# EAGLE design p1-001 (EAGLE 9.1.0)
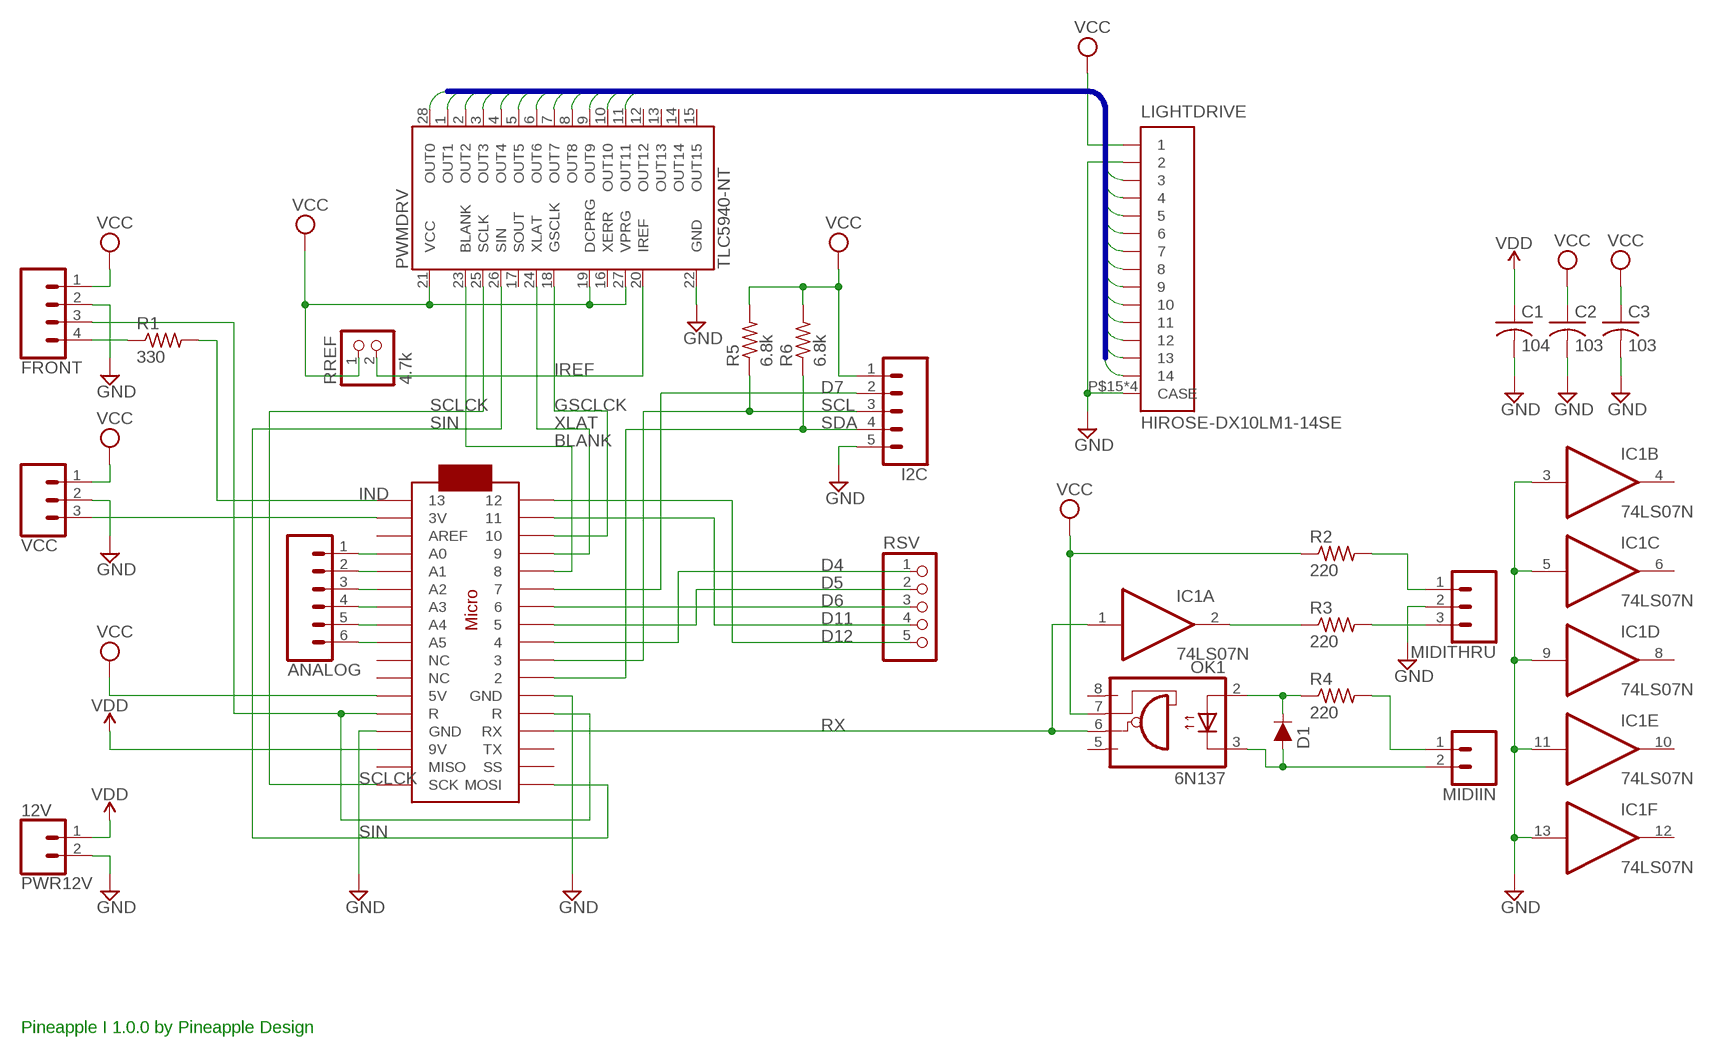
[diagram p0: schematic, sheet 1]

## Parts
ANALOG  CONN_061.27MM  [1X06_1.27MM]
C1  104  C-US025-025X050  [C025-025X050]
C2  103  C-US025-025X050  [C025-025X050]
C3  103  C-US025-025X050  [C025-025X050]
D1  DIODE-1N4148  [DIODE-1N4148]
FRONT  CONN_04JST-PTH  [JST-4-PTH]
I2C  CONN_05SMD2  [1X05_1MM_RA]
IC1  74LS07N  [DIL14]
LIGHTDRIVE  HIROSE-DX10LM1-14SE  [HIROSE-DX10LM1-14SE]
MIDIIN  CONN_02JST-PTH-2  [JST-2-PTH]
MIDITHRU  CONN_03JST-PTH  [JST-3-PTH]
OK1  6N137  [DIL08]
PWMDRV  TLC5940-NT  [DIL28-3]
PWR12V  12V  CONN_02JST-PTH-2  [JST-2-PTH]
R1  330  R-US_0204/5  [0204/5]
R2  220  R-US_0204/5  [0204/5]
R3  220  R-US_0204/5  [0204/5]
R4  220  R-US_0204/5  [0204/5]
R5  6.8k  R-US_0204/5  [0204/5]
R6  6.8k  R-US_0204/5  [0204/5]
RREF  4.7k  PINHD-1X2  [1X02]
RSV  PINHD-1X5  [1X05]
U$1  ARDUINOMICRO  [ARDUINOMICRO]
VCC  CONN_03JST-PTH  [JST-3-PTH]

## Nets
BLANK: PWMDRV.23(BLANK) U$1.P$5
D4: RSV.1 U$1.P$9
D5: RSV.2 U$1.P$8
D6: RSV.3 U$1.P$7
D7: I2C.2 U$1.P$6
D11: RSV.4 U$1.P$2
D12: RSV.5 U$1.P$1
GND: C1.2 C2.2 C3.2 FRONT.2 I2C.5 IC1.3(B:I) IC1.5(C:I) IC1.9(D:I) IC1.11(E:I) IC1.13(F:I) LIGHTDRIVE.P$2 LIGHTDRIVE.P$15(CASE) LIGHTDRIVE.P$16(CASE) LIGHTDRIVE.P$17(CASE) LIGHTDRIVE.P$18(CASE) MIDITHRU.2 PWMDRV.22(GND) PWR12V.2 U$1.P$12(GND) U$1.P$21(GND) VCC.2
GSCLCK: PWMDRV.18(GSCLK) U$1.P$3
IND: R1.2 U$1.P$34
IREF: PWMDRV.20(IREF) RREF.2
LD1: LIGHTDRIVE.P$3 PWMDRV.28(OUT0)
LD2: LIGHTDRIVE.P$4 PWMDRV.1(OUT1)
LD3: LIGHTDRIVE.P$5 PWMDRV.2(OUT2)
LD4: LIGHTDRIVE.P$6 PWMDRV.3(OUT3)
LD5: LIGHTDRIVE.P$7 PWMDRV.4(OUT4)
LD6: LIGHTDRIVE.P$8 PWMDRV.5(OUT5)
LD7: LIGHTDRIVE.P$9 PWMDRV.6(OUT6)
LD8: LIGHTDRIVE.P$10 PWMDRV.7(OUT7)
LD9: LIGHTDRIVE.P$11 PWMDRV.8(OUT8)
LD10: LIGHTDRIVE.P$12 PWMDRV.9(OUT9)
LD11: LIGHTDRIVE.P$13 PWMDRV.10(OUT10)
LD12: LIGHTDRIVE.P$14 PWMDRV.11(OUT11)
MIDIIN+: MIDIIN.1 R4.2
MIDIIN-: D1.A MIDIIN.2 OK1.3(C)
MIDITHRU+: MIDITHRU.1 R2.2
MIDITHRU-: MIDITHRU.3 R3.2
N$2: IC1.2(A:O) R3.1
N$3: FRONT.4 R1.1
N$5: D1.C OK1.2(A) R4.1
N$9: ANALOG.1 U$1.P$31(A0)
N$10: ANALOG.2 U$1.P$30(A1)
N$11: ANALOG.3 U$1.P$29(A2)
N$12: ANALOG.4 U$1.P$28(A3)
N$13: ANALOG.5 U$1.P$27(A4)
N$14: ANALOG.6 U$1.P$26(A5)
RST: FRONT.3 U$1.P$13(R) U$1.P$22(R)
RX: IC1.1(A:I) OK1.6(VO) U$1.P$14(RX)
SCL: I2C.3 R5.1 U$1.P$10
SCLCK: PWMDRV.25(SCLK) U$1.P$18(SCK)
SDA: I2C.4 R6.1 U$1.P$11
SIN: PWMDRV.26(SIN) U$1.P$17(MOSI)
V3V: U$1.P$33(3V) VCC.3
VCC: C2.1 C3.1 FRONT.1 I2C.1 LIGHTDRIVE.P$1 OK1.7(VE) PWMDRV.19(DCPRG) PWMDRV.21(VCC) PWMDRV.27(VPRG) R2.1 R5.2 R6.2 RREF.1 U$1.P$23(5V) VCC.1
VDD: C1.1 PWR12V.1 U$1.P$20(9V)
XLAT: PWMDRV.24(XLAT) U$1.P$4
Unconnected: IC1.4(B:O) IC1.6(C:O) IC1.8(D:O) IC1.10(E:O) IC1.12(F:O) OK1.5(GND) OK1.8(VCC) PWMDRV.12(OUT12) PWMDRV.13(OUT13) PWMDRV.14(OUT14) PWMDRV.15(OUT15) PWMDRV.16(XERR) PWMDRV.17(SOUT) U$1.P$15(TX) U$1.P$16(SS) U$1.P$19(MISO) U$1.P$24(NC) U$1.P$25(NC) U$1.P$32(AREF)

## Buses
LD[1..16]

## Notes on the sheet
- Pineapple I 1.0.0 by Pineapple Design

## Power pins joined to a net without a drawn wire
GND: IC1.7(P:GND)
VCC: IC1.14(P:VCC)

## Library data of the parts
ANALOG = SparkFun-Connectors:CONN_06: Multi connection point. Often used as Generic Header-pin footprint for 0.1 inch spaced/style header connections On any of the 0.1 inch spaced packages, you can populate with these: Break Away Headers - Straight <https://www.sparkfun.com/products/116> (PRT-00116) Break Away Male Headers - Right Angle <https://www.sparkfun.com/products/553> (PRT-00553) Female Headers <https://www.sparkfun.com/products/115> (PRT-00115) Break Away Headers - Machine Pin <https://www.sparkfun.com/products/117> (PRT-00117) Break Away Female Headers - Swiss Machine Pin <https://www.sparkfun.com/products/743> (PRT-00743) Arduino Stackable Header - 6 Pin <https://www.sparkfun.com/products/9280> (PRT-09280) For SCREWTERMINALS and SPRING TERMINALS visit here: Screw Terimnals on SparkFun.com <https://www.sparkfun.com/search/results?term=Screw+Terminals> (5mm/3.5mm/2.54mm spacing) This device is also useful as a general connection point to wire up your design to another part of your project. Our various solder wires solder well into these plated through hole pads. Hook-Up Wire - Assortment (Stranded, 22 AWG) <https://www.sparkfun.com/products/11375> (PRT-11375) Hook-Up Wire - Assortment (Solid Core, 22 AWG) <https://www.sparkfun.com/products/11367> (PRT-11367) View the entire wire category on our website here <https://www.sparkfun.com/categories/141>
C1-C3 = rcl:C-US: CAPACITOR, American symbol; SPICEPREFIX: C
D1 = SparkFun-DiscreteSemi:DIODE: Diode These are standard reverse protection diodes and small signal diodes. SparkFun Products: SparkFun SparkPunk Sound Kit <https://www.sparkfun.com/products/11177> SparkFun ESP8266 Thing <https://www.sparkfun.com/products/13231>; PROD_ID: DIO-08378; VALUE: 200mA/100V/1V
FRONT = SparkFun-Connectors:CONN_04: Multi connection point. Often used as Generic Header-pin footprint for 0.1 inch spaced/style header connections On any of the 0.1 inch spaced packages, you can populate with these: Break Away Headers - Straight <https://www.sparkfun.com/products/116> (PRT-00116) Break Away Male Headers - Right Angle <https://www.sparkfun.com/products/553> (PRT-00553) Female Headers <https://www.sparkfun.com/products/115> (PRT-00115) Break Away Headers - Machine Pin <https://www.sparkfun.com/products/117> (PRT-00117) Break Away Female Headers - Swiss Machine Pin <https://www.sparkfun.com/products/743> (PRT-00743) For SCREWTERMINALS and SPRING TERMINALS visit here: Screw Terimnals on SparkFun.com <https://www.sparkfun.com/search/results?term=Screw+Terminals> (5mm/3.5mm/2.54mm spacing) This device is also useful as a general connection point to wire up your design to another part of your project. Our various solder wires solder well into these plated through hole pads. Hook-Up Wire - Assortment (Stranded, 22 AWG) <https://www.sparkfun.com/products/11375> (PRT-11375) Hook-Up Wire - Assortment (Solid Core, 22 AWG) <https://www.sparkfun.com/products/11367> (PRT-11367) View the entire wire category on our website here <https://www.sparkfun.com/categories/141> Special notes: Molex polarized connector foot print use with SKU : PRT-08231 with associated crimp pins and housings. 1MM SMD Version SKU: PRT-10208; PROD_ID: WIRE-13531; SF_ID: PRT-09916
I2C = SparkFun-Connectors:CONN_05: Multi connection point. Often used as Generic Header-pin footprint for 0.1 inch spaced/style header connections On any of the 0.1 inch spaced packages, you can populate with these: Break Away Headers - Straight <https://www.sparkfun.com/products/116> (PRT-00116) Break Away Male Headers - Right Angle <https://www.sparkfun.com/products/553> (PRT-00553) Female Headers <https://www.sparkfun.com/products/115> (PRT-00115) Break Away Headers - Machine Pin <https://www.sparkfun.com/products/117> (PRT-00117) Break Away Female Headers - Swiss Machine Pin <https://www.sparkfun.com/products/743> (PRT-00743) For SCREWTERMINALS and SPRING TERMINALS visit here: Screw Terimnals on SparkFun.com <https://www.sparkfun.com/search/results?term=Screw+Terminals> (5mm/3.5mm/2.54mm spacing) This device is also useful as a general connection point to wire up your design to another part of your project. Our various solder wires solder well into these plated through hole pads. Hook-Up Wire - Assortment (Stranded, 22 AWG) <https://www.sparkfun.com/products/11375> (PRT-11375) Hook-Up Wire - Assortment (Solid Core, 22 AWG) <https://www.sparkfun.com/products/11367> (PRT-11367) View the entire wire category on our website here <https://www.sparkfun.com/categories/141> Special notes: Molex polarized connector foot print use with SKU : PRT-08231 with associated crimp pins and housings. 1MM SMD Version SKU: PRT-10208
IC1 = 74xx-us:74*07: Hex BUFFER, open collector high-voltage output
LIGHTDRIVE = con-hirose-dx10lm1-14se:HIROSE-DX10LM1-14SE: AXR30545 Plug (Board mounting type) B type Source: http://www.panasonic-electric-works.ch/home/www/catalogues/connector/download/en_ds_65201_0000.pdf; MPN: AXR30545; OC_FARNELL: unknown; OC_NEWARK: 11N4069
MIDIIN PWR12V = SparkFun-Connectors:CONN_02: Multi connection point. Often used as Generic Header-pin footprint for 0.1 inch spaced/style header connections On any of the 0.1 inch spaced packages, you can populate with these: Break Away Headers - Straight <https://www.sparkfun.com/products/116> (PRT-00116) Break Away Male Headers - Right Angle <https://www.sparkfun.com/products/553> (PRT-00553) Female Headers <https://www.sparkfun.com/products/115> (PRT-00115) Break Away Headers - Machine Pin <https://www.sparkfun.com/products/117> (PRT-00117) Break Away Female Headers - Swiss Machine Pin <https://www.sparkfun.com/products/743> (PRT-00743) For SCREWTERMINALS and SPRING TERMINALS visit here: Screw Terimnals on SparkFun.com <https://www.sparkfun.com/search/results?term=Screw+Terminals> (5mm/3.5mm/2.54mm spacing) This device is also useful as a general connection point to wire up your design to another part of your project. Our various solder wires solder well into these plated through hole pads. Hook-Up Wire - Assortment (Stranded, 22 AWG) <https://www.sparkfun.com/products/11375> (PRT-11375) Hook-Up Wire - Assortment (Solid Core, 22 AWG) <https://www.sparkfun.com/products/11367> (PRT-11367) View the entire wire category on our website here <https://www.sparkfun.com/categories/141> Special notes: Molex polarized connector foot print use with: PRT-08233 with associated crimp pins and housings. 2.54_SCREWTERM for use with PRT-10571. 3.5mm Screw Terminal footprints for PRT-08084 5mm Screw Terminal footprints for use with PRT-08432; PROD_ID: CONN-09863; SKU: PRT-09914
MIDITHRU VCC = SparkFun-Connectors:CONN_03: Multi connection point. Often used as Generic Header-pin footprint for 0.1 inch spaced/style header connections On any of the 0.1 inch spaced packages, you can populate with these: Break Away Headers - Straight <https://www.sparkfun.com/products/116> (PRT-00116) Break Away Male Headers - Right Angle <https://www.sparkfun.com/products/553> (PRT-00553) Female Headers <https://www.sparkfun.com/products/115> (PRT-00115) Break Away Headers - Machine Pin <https://www.sparkfun.com/products/117> (PRT-00117) Break Away Female Headers - Swiss Machine Pin <https://www.sparkfun.com/products/743> (PRT-00743) Stackable Header - 3 Pin (Female, 0.1") <https://www.sparkfun.com/products/13875> (PRT-13875) For SCREWTERMINALS and SPRING TERMINALS visit here: Screw Terimnals on SparkFun.com <https://www.sparkfun.com/search/results?term=Screw+Terminals> (5mm/3.5mm/2.54mm spacing) This device is also useful as a general connection point to wire up your design to another part of your project. Our various solder wires solder well into these plated through hole pads. Hook-Up Wire - Assortment (Stranded, 22 AWG) <https://www.sparkfun.com/products/11375> (PRT-11375) Hook-Up Wire - Assortment (Solid Core, 22 AWG) <https://www.sparkfun.com/products/11367> (PRT-11367) View the entire wire category on our website here <https://www.sparkfun.com/categories/141> Special notes: Molex polarized connector foot print use with SKU : PRT-08232 with associated crimp pins and housings.; PROD_ID: WIRE-10037; SF_ID: PRT-09915
OK1 = optocoupler:6N137: MOTOROLA OPTO COUPLER; MPN: 6N137; OC_FARNELL: 1328376; OC_NEWARK: 52M1895
PWMDRV = SparkFun-Retired:TLC5940: 16-channel LED Driver with Dot Correction and Grayscale PWM Control The TLC5940 is a 16-channel, constant-current sink LED driver. Each channel has an individually adjustable 4096-step grayscale PWM brightness control and a 64-step, constant-current sink (dot correction). The dot correction adjusts the brightness variations between LED channels and other LED drivers. The dot correction data is stored in an integrated EEPROM. Both grayscale control and dot correction are accessible via a serial interface. A single external resistor sets the maximum current value of all 16 channels. Packages: 28-pin HTSSOP 32-pin 5x5mm QFN 28-pin DIP
R1-R6 = resistor:R-US_: RESISTOR, American symbol
RREF = pinhead:PINHD-1X2: PIN HEADER
RSV = pinhead:PINHD-1X5: PIN HEADER
U$1 = adafruit:ARDUINOMICRO

## Net classes
0 default: width 0.254 mm, drill 0.254 mm, clearance 0.254 mm

## Board
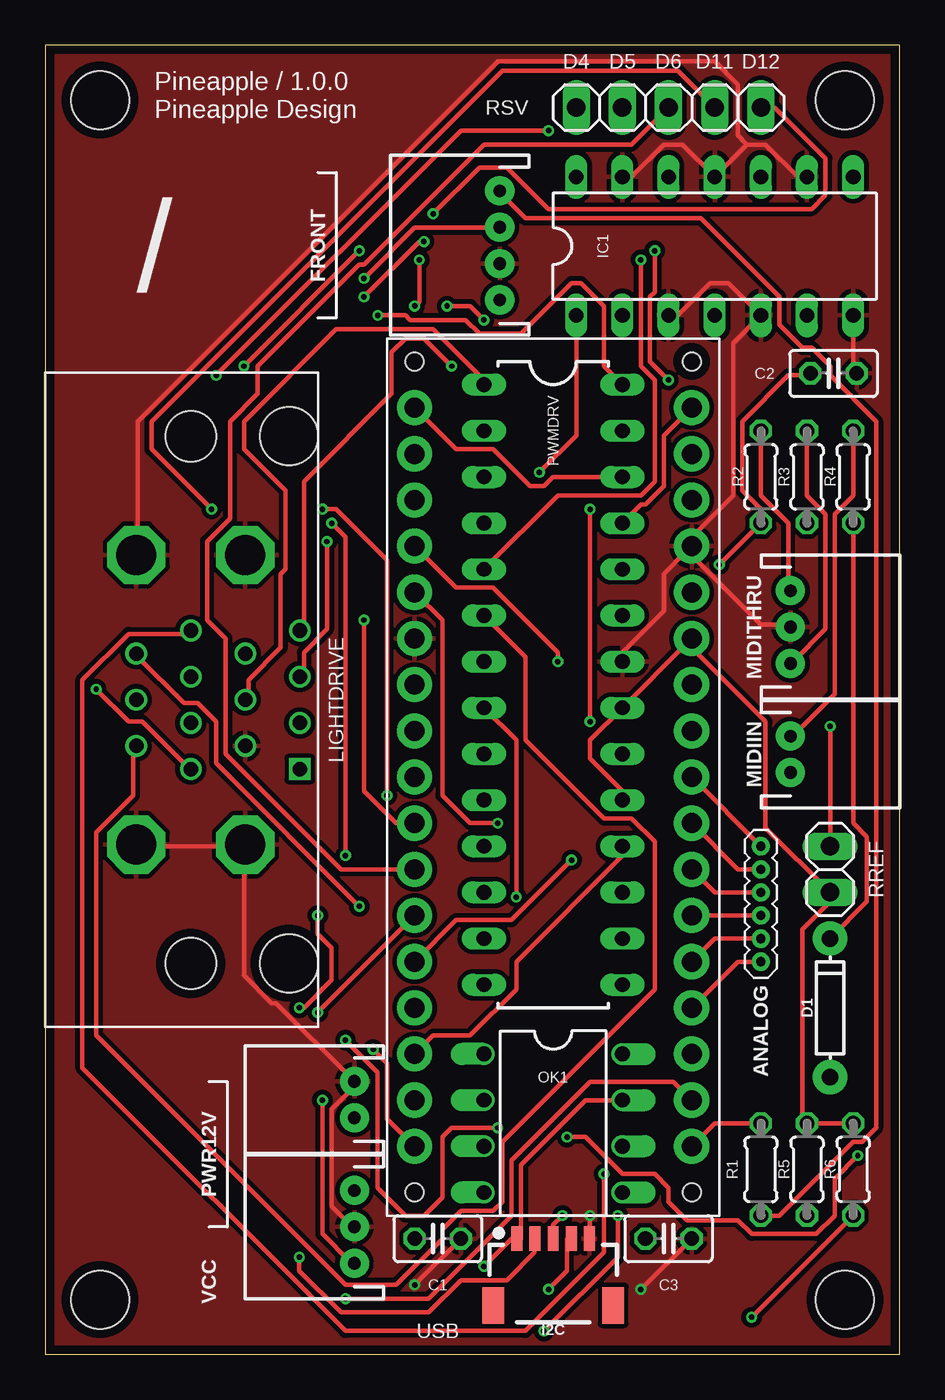
[diagram p1: board, top side]
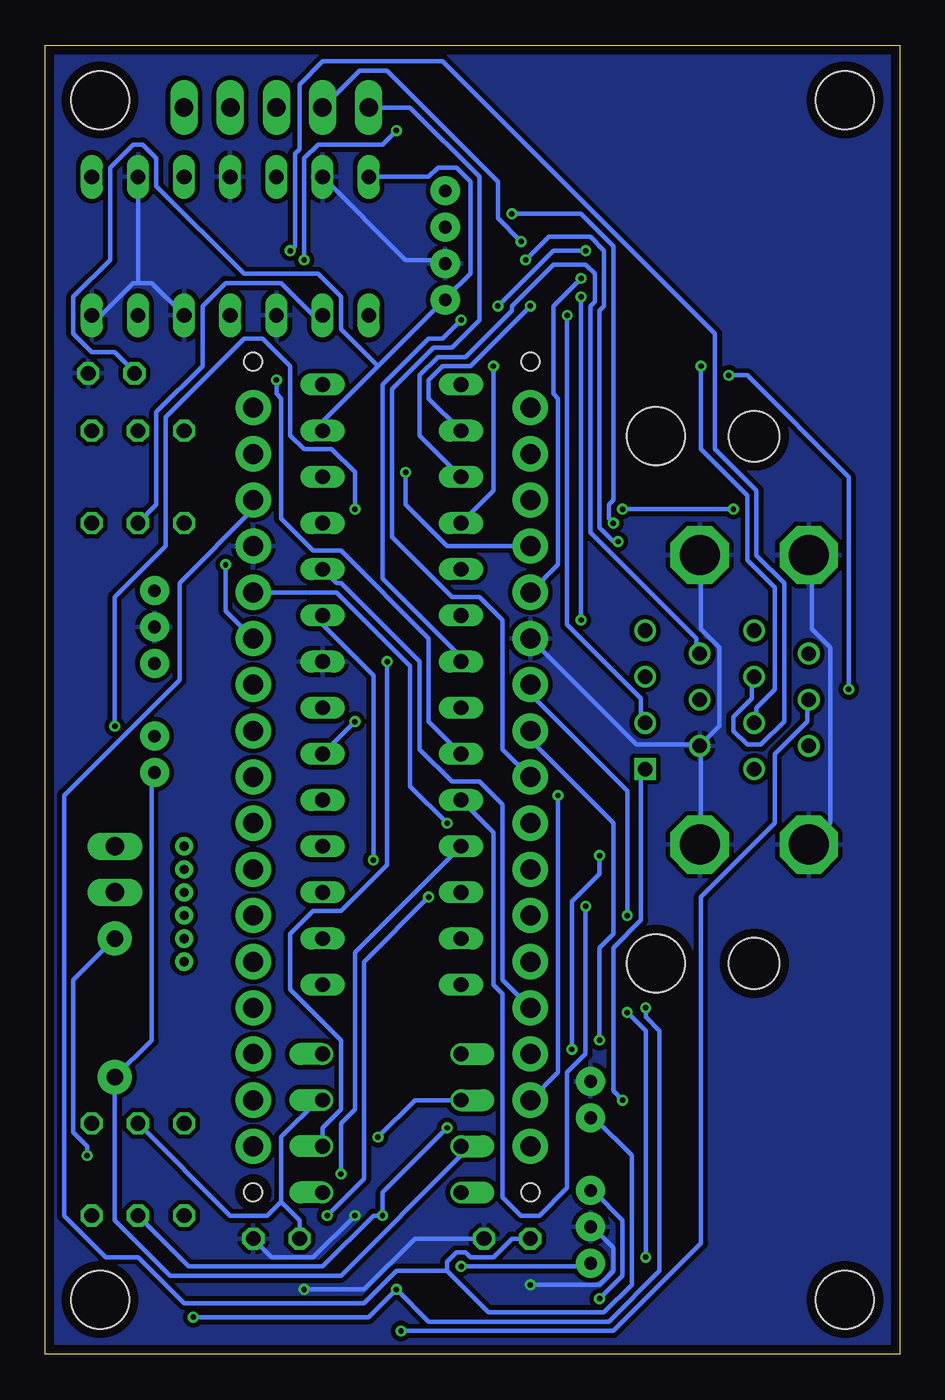
[diagram p2: board, bottom side, seen from below]

Size 47 x 72 mm. Coordinates in mm from the lower left corner, seen from the top.
Outline: 0,0 47,0 47,72 0,72 0,0
Copper layers (1*16): Top 0.035mm / dielectric 1.53mm / Bottom 0.035mm
Design rules "pban_5mil-l2": minimum track width 5mil, minimum drill 0.3mm, track to track 5mil, track to pad 0.229mm, pad to pad 5mil, via to via 5mil, smd to smd 5mil, copper to edge 0.5mm, drill to drill 0.5mm, minimum pad ring 0.15mm, minimum via ring 0.15mm, stop-mask expansion 4mil, vias tented up to drill 0.35mm, thermal gap 10mil
Holes 3.2 mm at 3,3 44,3 44,69 3,69
Holes 1 mm at 20.32,8.89 35.56,8.89 20.32,54.61 35.56,54.61

### Footprints (pad centres in the part's own frame; a part is rotated, then mirrored left to right if it is on the bottom)
1X06_1.27MM = drill 0.508 pad 1: 1 0,0; 2 1.27,0; 3 2.54,0; 4 3.81,0; 5 5.08,0; 6 6.35,0
C025-025X050 = drill 0.813 octagon: 1 -1.27,0; 2 1.27,0
DIODE-1N4148 = drill 0.9 pad 1.88: A -3.81,0; C 3.81,0
JST-4-PTH = drill 0.7 pad 1.6: 1 -3,0; 2 -1,0; 3 1,0; 4 3,0
1X05_1MM_RA = smd 0.6 x 1.35: 1 -2,0; 2 -1,0; 3 0,0; 4 1,0; 5 2,0 | smd 1.2 x 2: NC1 3.3,-3.675; NC2 -3.3,-3.675
DIL14 = drill 0.813 long: 1 -7.62,-3.81; 2 -5.08,-3.81; 3 -2.54,-3.81; 4 0,-3.81; 5 2.54,-3.81; 6 5.08,-3.81; 7 7.62,-3.81; 8 7.62,3.81; 9 5.08,3.81; 10 2.54,3.81; 11 0,3.81; 12 -2.54,3.81; 13 -5.08,3.81; 14 -7.62,3.81
HIROSE-DX10LM1-14SE = drill 0.8 square: P$1 3.81,9 | drill 0.8: P$2 2.54,6; P$3 1.27,9; P$4 0,6; P$5 -1.27,9; P$6 -2.54,6; P$7 -3.81,9; P$8 3.81,3; P$9 2.54,0; P$10 1.27,3; P$11 0,0; P$12 -1.27,3; P$13 -2.54,0; P$14 -3.81,3 | drill 2.2 octagon: P$15 -7.97,0; P$16 7.97,0; P$17 7.97,6; P$18 -7.97,6 | hole 2.8: -14.5,3; 14.5,3 | hole 3.2: -14.5,8.4; 14.5,8.4
JST-2-PTH = drill 0.7 pad 1.6: 1 -1,0; 2 1,0
JST-3-PTH = drill 0.7 pad 1.6: 1 -2,0; 2 0,0; 3 2,0
DIL08 = drill 0.813 offset: 1 -3.81,-3.81; 2 -1.27,-3.81; 3 1.27,-3.81; 4 3.81,-3.81; 5 3.81,3.81; 6 1.27,3.81; 7 -1.27,3.81; 8 -3.81,3.81
DIL28-3 = drill 0.813 long: 1 -16.51,-3.81; 2 -13.97,-3.81; 3 -11.43,-3.81; 4 -8.89,-3.81; 5 -6.35,-3.81; 6 -3.81,-3.81; 7 -1.27,-3.81; 8 1.27,-3.81; 9 3.81,-3.81; 10 6.35,-3.81; 11 8.89,-3.81; 12 11.43,-3.81; 13 13.97,-3.81; 14 16.51,-3.81; 15 16.51,3.81; 16 13.97,3.81; 17 11.43,3.81; 18 8.89,3.81; 19 6.35,3.81; 20 3.81,3.81; 21 1.27,3.81; 22 -1.27,3.81; 23 -3.81,3.81; 24 -6.35,3.81; 25 -8.89,3.81; 26 -11.43,3.81; 27 -13.97,3.81; 28 -16.51,3.81
0204/5 = drill 0.813 octagon: 1 -2.54,0; 2 2.54,0
1X02 = drill 1.016 long: 1 -1.27,0; 2 1.27,0
1X05 = drill 1.016 long: 1 -5.08,0; 2 -2.54,0; 3 0,0; 4 2.54,0; 5 5.08,0
ARDUINOMICRO = drill 1.1 pad 1.93: P$1 -20.32,7.62; P$2 -17.78,7.62; P$3 -15.24,7.62; P$4 -12.7,7.62; P$5 -10.16,7.62; P$6 -7.62,7.62; P$7 -5.08,7.62; P$8 -2.54,7.62; P$9 0,7.62; P$10 2.54,7.62; P$11 5.08,7.62; P$12 12.7,-7.62; P$13 10.16,-7.62; P$14 12.7,7.62; P$15 15.24,7.62; P$16 17.78,7.62; P$17 20.32,7.62; P$18 20.32,-7.62; P$19 17.78,-7.62; P$20 15.24,-7.62; P$21 7.62,7.62; P$22 10.16,7.62; P$23 7.62,-7.62; P$24 5.08,-7.62; P$25 2.54,-7.62; P$26 0,-7.62; P$27 -2.54,-7.62; P$28 -5.08,-7.62; P$29 -7.62,-7.62; P$30 -10.16,-7.62; P$31 -12.7,-7.62; P$32 -15.24,-7.62; P$33 -17.78,-7.62; P$34 -20.32,-7.62

### Placement (x,y rotation side)
ANALOG  39.37,21.59 90 top
C1  21.59,6.35 0 top
C2  43.37,53.96 0 top
C3  34.29,6.35 0 top
D1  43.18,19.05 90 top
FRONT  25,61 90 top
I2C  27.94,6.35 0 top
IC1  36.83,60.96 0 top
LIGHTDRIVE  5,36 270 top
MIDIIN  41,33 270 top
MIDITHRU  41,40 270 top
OK1  27.94,12.7 270 top
PWMDRV  27.94,36.83 270 top
PWR12V  17,14 90 top
R1  39.37,10.16 90 top
R2  39.37,48.26 90 top
R3  41.91,48.26 90 top
R4  44.45,48.26 90 top
R5  41.91,10.16 90 top
R6  44.45,10.16 90 top
RREF  43.18,26.67 90 top
RSV  34.29,68.58 0 top
U$1  27.94,31.75 90 top
VCC  17,7 90 top

### Tracks (layer width: path | path; a pad name or v marks a point on that pad's centre or on a via)
BLANK  (via drill 0.3)
  Top 0.254: v28.96,27.18 25.65,23.88 22.61,23.88 U$1.P$5
  Bottom 0.254: PWMDRV.23 31.75,40.13 28.96,37.34 v28.96,27.18
D4
  Bottom 0.254: RSV.1 26.92,68.58 23.11,64.77 23.11,56.9 24.64,55.37 25.65,55.37 27.94,53.09 27.94,44.96 24.64,41.66 23.11,41.66 21.84,40.39 21.84,33.27 U$1.P$9
D5  (via drill 0.3)
  Top 0.254: v20.83,61.21 20.57,61.21 v17.53,58.17 | v17.53,40.39 17.53,30.99 19.3,29.21 U$1.P$8
  Bottom 0.254: RSV.2 29.72,70.61 28.19,70.61 22.1,64.52 22.1,62.48 v20.83,61.21 | v17.53,40.39 v17.53,58.17
D6
  Top 0.254: RSV.3 32.26,66.55 24.13,66.55 17.53,59.94 17.27,59.94 11.68,54.36 11.68,52.83 10.16,51.31 10.16,45.97 8.89,44.7 8.89,40.39 9.91,39.37 9.91,33.02 16.26,26.67 U$1.P$7
D7  (via drill 0.3)
  Top 0.254: v13.97,5.33 13.97,4.57 16.26,2.29 21.08,2.29 22.86,4.06 25.4,4.06 26.92,5.59 26.92,6.35 I2C.2 | U$1.P$6 v14.99,18.8
  Bottom 0.254: v13.97,5.33 13.97,17.78 v14.99,18.8
D11  (via drill 0.3)
  Top 0.254: RSV.4 34.8,70.61 25.15,70.61 5.84,51.31 5.84,49.78 v9.14,46.48 | v15.24,46.48 16,46.48 18.8,43.69 v18.8,30.73
  Bottom 0.254: v15.24,46.48 v9.14,46.48 | v18.8,30.73 18.8,15.49 U$1.P$2
D12  (via drill 0.3)
  Top 0.254: RSV.5 40.13,68.58 42.93,65.79 42.93,63.75 42.16,62.99 27.69,62.99 25.4,65.28 23.88,65.28 v21.34,62.74 | v15.75,45.72 16.51,44.96 v16.51,27.43 | v18.03,16.76 18.8,16 18.8,12.95 U$1.P$1
  Bottom 0.254: v21.34,62.74 17.53,62.74 15.75,60.96 15.75,46.99 16,46.74 16,45.97 v15.75,45.72 | v16.51,27.43 16.51,26.42 18.03,24.89 v18.03,16.76
GND  (via drill 0.3)
  Top 0.254: PWMDRV.22 31.75,38.61 34.04,40.89 34.04,42.93 35.31,44.2 | 35.31,44.2 39.37,40.13 40.89,40.13 MIDITHRU.2 | 35.31,44.2 U$1.P$12 35.56,44.96 37.85,47.24 37.85,55.63 IC1.5 37.59,58.93 36.58,58.93 34.8,57.15 IC1.3 | IC1.7 44.45,54.1 C2.2 | IC1.13 32.26,64.77 34.04,66.55 35.05,66.55 IC1.11 38.61,66.55 | IC1.9 41.4,64.77 39.62,66.55 38.61,66.55 | v29.97,7.62 29.97,6.35 I2C.5 | v20.32,3.81 C1.2 | VCC.2 16.76,7.11 15.75,8.13 15.75,13.46 16.76,14.48 16.76,14.99 PWR12V.2 16.76,15.24 12.7,19.3 12.45,19.3 10.92,20.83 10.92,27.94 | v32.77,3.56 C3.2 | 10.92,27.94 5.08,27.94 LIGHTDRIVE.P$16 | 10.92,27.94 LIGHTDRIVE.P$17 | 38.61,66.55 38.1,67.06 38.1,69.85 36.83,71.12 24.89,71.12 5.08,51.31 5.08,44.2 LIGHTDRIVE.P$15
  Bottom 0.254: IC1.7 43.94,57.15 42.16,58.93 41.91,58.93 | 41.91,58.93 41.15,58.93 IC1.5 | IC1.13 27.18,60.2 25.15,60.2 FRONT.2 | IC1.9 41.91,58.93 | v29.97,7.62 32.26,5.33 34.54,5.33 C3.2 | v20.32,3.81 16.51,3.81 15.75,4.57 15.75,5.84 16.76,6.86 VCC.2 | v32.77,3.56 29.46,3.56 26.67,6.35 C1.2 | LIGHTDRIVE.P$2 10.92,33.27 10.92,28.19 LIGHTDRIVE.P$17 | U$1.P$21 14.48,33.53 11.18,33.53 LIGHTDRIVE.P$2 | LIGHTDRIVE.P$15 4.83,43.94 4.83,39.88 3.81,38.86 3.81,29.21 4.83,28.19 LIGHTDRIVE.P$16 | LIGHTDRIVE.P$18 10.92,43.94 10.92,39.88 9.91,38.86 9.91,34.54 10.92,33.53 LIGHTDRIVE.P$2
  pour Top: 0,0 47,0 47,72 0,72
  pour Bottom: 0,0 47,0 47,72 0,72
GSCLCK
  Top 0.254: PWMDRV.18 31.75,27.43 25.91,21.59 25.91,20.07 23.37,17.53 21.34,17.53 U$1.P$3
IND
  Top 0.254: R1.2 36.83,12.7 U$1.P$34
IREF  (via drill 0.3)
  Top 0.254: v29.97,46.48 v29.97,34.8 | RREF.2 v43.18,34.54
  Bottom 0.254: v29.97,34.8 PWMDRV.20 | v29.97,46.48 29.97,48.51 31.24,49.78 32.77,49.78 33.53,50.55 33.53,54.36 35.05,55.88 36.07,55.88 40.39,51.56 40.39,44.45 43.18,41.66 v43.18,34.54
LD1  (via drill 0.3)
  Top 0.254: v18.29,57.15 19.81,57.15 20.07,56.9 23.11,56.9 23.88,56.13 26.16,56.13 28.96,58.93 29.46,58.93 30.73,57.66 30.73,54.36 PWMDRV.28
  Bottom 0.254: v18.29,57.15 18.29,40.13 14.22,36.07 14.22,34.8 LIGHTDRIVE.P$3
LD2
  Top 0.254: PWMDRV.1 24.13,53.59 21.34,56.39 16,56.39 10.92,51.31 10.92,49.78 13.21,47.5 13.21,43.18 12.95,42.93 12.95,38.86 11.18,37.08 11.18,36.07 LIGHTDRIVE.P$4
LD3  (via drill 0.3)
  Top 0.254: v15.49,44.7 15.49,39.88 14.22,38.61 14.22,37.34 LIGHTDRIVE.P$5 | v20.57,60.2 20.57,57.91 v20.32,57.66
  Bottom 0.254: v15.49,44.7 15.75,44.7 16.51,45.47 16.51,57.4 16.26,57.66 16.26,60.71 17.02,61.47 19.3,61.47 v20.57,60.2 | v20.32,57.66 23.62,54.36 25.15,54.36 25.91,53.59 25.91,52.58 PWMDRV.2
LD4
  Bottom 0.254: PWMDRV.3 26.42,50.55 26.42,53.85 25.4,54.86 23.88,54.86 21.34,57.4 21.34,57.66 19.05,59.94 17.27,59.94 16.76,59.44 16.76,57.91 17.02,57.66 17.02,45.21 11.18,39.37 11.18,38.61 LIGHTDRIVE.P$6
LD5  (via drill 0.3)
  Top 0.254: v22.35,54.36 20.83,55.88 19.81,55.88 19.05,55.12 19.05,52.83 14.22,48.01 14.22,39.88 LIGHTDRIVE.P$7
  Bottom 0.254: v22.35,54.36 22.35,47.5 PWMDRV.4
LD6  (via drill 0.3)
  Top 0.254: v2.79,36.58 4.57,34.8 5.33,34.8 7.87,32.26 LIGHTDRIVE.P$8 | v9.4,53.85 22.86,67.31 v27.69,67.31 | v32.77,60.2 32.77,54.36 33.53,53.59 33.53,48.01 32.77,47.24 28.19,47.24 PWMDRV.5
  Bottom 0.254: v2.79,36.58 2.79,48.26 8.38,53.85 v9.4,53.85 | v27.69,67.31 28.45,66.55 32,66.55 32.77,65.79 v32.77,60.2
LD7
  Top 0.254: PWMDRV.6 26.42,38.35 26.42,33.78 30.73,29.46 32.26,29.46 33.53,28.19 33.53,20.07 25.15,11.68 25.15,8.38 24.64,7.87 22.86,7.87 21.84,6.86 21.84,6.35 19.3,3.81 16.51,3.81 2.79,17.53 2.79,28.7 4.83,30.73 4.83,33.27 LIGHTDRIVE.P$9
LD8  (via drill 0.3)
  Top 0.254: v17.27,60.71 v10.92,54.36 | v22.1,57.66 23.37,57.66 v24.13,56.9
  Bottom 0.254: v10.92,54.36 10.92,49.78 8.38,47.24 8.38,43.69 6.86,42.16 6.86,36.58 7.87,35.56 7.87,34.8 LIGHTDRIVE.P$10 | v17.27,60.71 19.05,60.71 v22.1,57.66 | v24.13,56.9 25.15,55.88 25.91,55.88 28.45,53.34 28.45,42.67 24.13,38.35 PWMDRV.7
LD9  (via drill 0.3)
  Top 0.254: v27.43,1.27 31.5,5.33 v31.5,7.62 | v25.91,25.15 25.91,33.78 PWMDRV.8
  Bottom 0.254: v27.43,1.27 15.75,1.27 10.92,6.1 10.92,25.15 6.86,29.21 6.86,33.02 5.08,34.8 5.08,35.81 LIGHTDRIVE.P$11 | v31.5,7.62 29.46,9.65 29.46,21.59 v25.91,25.15
LD10  (via drill 0.3)
  Top 0.254: v33.53,60.71 33.53,58.42 33.27,58.17 33.27,54.61 v34.29,53.59
  Bottom 0.254: v33.53,60.71 33.27,60.96 33.27,66.04 33.02,66.29 33.02,69.85 31.75,71.12 25.15,71.12 10.16,56.13 10.16,49.78 7.87,47.5 7.87,43.94 6.35,42.42 6.35,34.8 7.62,33.53 8.38,33.53 9.14,34.29 9.14,35.05 8.13,36.07 8.13,37.08 LIGHTDRIVE.P$12 | v34.29,53.59 34.29,52.83 34.04,52.58 34.04,45.97 32.26,44.2 30.73,44.2 25.91,39.37 25.91,34.8 PWMDRV.9
LD11  (via drill 0.3)
  Top 0.254: v17.27,24.64 9.4,32.51 9.4,34.8 8.38,35.81 7.62,35.81 5.08,38.35 LIGHTDRIVE.P$13
  Bottom 0.254: v17.27,24.64 17.27,16.51 18.29,15.49 18.29,9.14 19.81,7.62 20.83,7.62 21.84,8.64 21.84,19.81 22.35,20.32 22.35,28.7 PWMDRV.10
LD12  (via drill 0.3)
  Top 0.254: v30.73,9.91 30.73,5.59 26.42,1.27 16.51,1.27 2.03,15.75 2.03,37.08 4.57,39.62 7.87,39.62 LIGHTDRIVE.P$14
  Bottom 0.254: v30.73,9.91 30.73,12.7 29.97,13.46 29.97,22.1 PWMDRV.11
MIDIIN+
  Top 0.254: R4.2 44.45,47.24 43.43,46.23 43.43,36.32 41.15,34.04 MIDIIN.1
MIDIIN-
  Bottom 0.254: OK1.3 24.13,10.92 30.73,4.32 40.13,4.32 43.18,7.37 D1.A 41.15,17.27 41.15,31.75 MIDIIN.2
MIDITHRU+
  Top 0.254: R2.2 39.37,47.24 40.89,45.72 40.89,42.16 MIDITHRU.1
MIDITHRU-
  Top 0.254: R3.2 41.91,47.24 42.93,46.23 42.93,39.88 41.15,38.1 MIDITHRU.3
N$2
  Bottom 0.254: IC1.2 32.26,57.15 34.04,58.93 37.08,58.93 38.35,57.66 38.35,54.36 40.89,51.82 40.89,46.74 R3.1
N$3
  Top 0.254: R1.1 40.39,7.62 44.45,11.68 44.96,11.68 45.72,12.45 45.72,51.31 43.18,53.85 43.18,54.36 42.16,55.37 41.66,55.37 40.39,56.64 40.39,58.17 36.07,62.48 26.42,62.48 25.15,63.75 FRONT.4
N$5  (via drill 0.3)
  Top 0.254: v28.7,11.94 29.72,11.94 31.75,9.91 33.53,9.91 34.29,9.14 34.29,8.38 35.31,7.37 38.1,7.37 38.86,6.6 42.42,6.6 43.43,7.62 43.43,9.65 v44.7,10.92 | R4.1 44.45,29.21 45.21,28.45 45.21,24.89 D1.C
  Bottom 0.254: OK1.2 26.67,13.97 v28.7,11.94 | v44.7,10.92 44.7,11.43 45.47,12.19 45.47,20.57 D1.C
N$9
  Top 0.254: ANALOG.1 38.1,21.59 U$1.P$31
N$10
  Top 0.254: ANALOG.2 36.83,22.86 U$1.P$30
N$11
  Top 0.254: U$1.P$29 ANALOG.3
N$12
  Top 0.254: ANALOG.4 36.83,25.4 U$1.P$28
N$13
  Top 0.254: ANALOG.5 38.1,26.67 U$1.P$27
N$14
  Top 0.254: U$1.P$26 ANALOG.6
RST  (via drill 0.3)
  Top 0.254: v17.53,59.18 20.32,61.98 24.89,61.98 FRONT.3 | v24.89,29.21 23.37,29.21 21.84,30.73 21.84,40.39 U$1.P$22
  Bottom 0.254: v17.53,59.18 19.05,57.66 19.05,52.83 18.8,52.58 18.8,43.43 U$1.P$22 | U$1.P$13 30.99,41.91 26.92,37.85 26.92,31.24 v24.89,29.21
RX  (via drill 0.3)
  Top 0.254: v28.19,38.1 28.19,38.61 24.64,42.16 22.61,42.16 U$1.P$14 | IC1.1 29.21,50.55 v27.18,48.51
  Bottom 0.254: OK1.6 31.75,12.45 30.73,13.46 30.73,17.27 33.53,20.07 33.53,23.11 32.26,24.38 30.73,24.38 28.19,26.92 v28.19,38.1 | v27.18,48.51 27.18,46.74 24.89,44.45 U$1.P$14
SCL  (via drill 0.3)
  Top 0.254: I2C.3 27.94,7.11 v28.45,7.62 | v16.51,17.27 18.29,15.49 18.29,9.14 19.81,7.62 20.83,7.62 21.84,8.64 21.84,11.94 22.35,12.45 v24.89,12.45
  Bottom 0.254: R5.1 39.12,4.83 31.75,4.83 28.96,7.62 v28.45,7.62 28.45,8.89 v24.89,12.45 | U$1.P$10 20.32,33.78 15.75,29.21 15.75,23.11 16.51,22.35 v16.51,17.27
SCLCK
  Top 0.254: PWMDRV.25 32.77,46.74 33.02,46.74 34.04,47.75 34.04,50.55 U$1.P$18
SDA  (via drill 0.3)
  Top 0.254: v27.69,3.56 28.7,4.57 28.7,6.35 I2C.4 | R6.1 v38.86,2.03 | v14.99,24.13 14.99,23.11 15.75,22.35 15.75,20.57 14.22,19.05 v13.97,19.05
  Bottom 0.254: v38.86,2.03 29.21,2.03 v27.69,3.56 25.91,1.78 16,1.78 13.21,4.57 13.21,17.78 13.97,18.54 v13.97,19.05 | U$1.P$11 20.32,36.32 14.99,30.99 v14.99,24.13
SIN
  Top 0.254: PWMDRV.26 27.94,48.26 27.43,47.75 26.67,47.75 24.64,49.78 22.61,49.78 U$1.P$17
V3V  (via drill 0.3)
  Top 0.254: v16.51,3.05 21.08,3.05 25.65,7.62 25.65,10.67 29.97,14.99 34.54,14.99 U$1.P$33
  Bottom 0.254: v16.51,3.05 15.24,4.32 15.24,7.37 16.76,8.89 VCC.3
VCC  (via drill 0.3)
  Top 0.254: C2.1 41.91,53.85 40.89,53.85 38.35,51.31 38.35,47.5 39.37,46.48 R2.1 v37.08,43.43 | PWMDRV.19 31.75,30.99 29.97,32.77 29.97,33.78 PWMDRV.21 35.31,39.12 | v15.24,13.97 15.24,6.6 16.76,5.08 VCC.1 | OK1.7 29.72,13.97 26.16,10.41 26.16,6.35 I2C.1 25.65,6.35 v24.13,4.83 | R6.2 R5.2 41.66,12.95 41.66,23.37 43.18,24.89 RREF.1 39.62,28.96 39.62,34.8 35.31,39.12 | 35.31,39.12 U$1.P$23
  Bottom 0.254: PWMDRV.27 31.75,51.31 28.7,54.36 | 28.7,54.36 25.15,57.91 FRONT.1 24.89,58.17 23.62,59.44 23.62,64.52 24.38,65.28 25.4,65.28 25.91,64.77 IC1.14 | v37.08,43.43 37.08,40.89 U$1.P$23 | 28.7,54.36 30.73,56.39 30.73,58.17 32,59.44 36.07,59.44 40.89,64.26 40.89,65.79 41.66,66.55 42.16,66.55 43.43,65.28 43.43,60.2 45.47,58.17 45.47,56.13 44.45,55.12 43.18,55.12 42.16,54.1 C2.1 | v15.24,13.97 15.75,14.48 15.75,22.35 14.22,23.88 14.22,32 LIGHTDRIVE.P$1 | C3.1 33.02,7.37 34.04,8.38 | 34.04,8.38 34.04,11.94 32,13.97 OK1.7 | 34.04,8.38 34.8,7.62 36.83,7.62 R5.2 | v24.13,4.83 17.02,4.83 VCC.1
VDD
  Bottom 0.254: C1.1 21.34,6.35 22.35,5.33 23.62,5.33 23.88,5.59 24.38,5.59 24.89,5.08 24.89,4.57 | 24.89,4.57 22.61,2.29 16.26,2.29 14.73,3.81 14.73,10.92 16.76,12.95 PWR12V.1 | U$1.P$20 35.56,46.48 39.62,42.42 39.62,37.08 45.97,30.73 45.97,7.62 43.69,5.33 41.91,5.33 39.37,2.79 29.46,2.79 27.69,4.57 24.89,4.57
XLAT
  Bottom 0.254: PWMDRV.24 30.99,42.42 30.73,42.42 26.42,38.1 26.42,33.27 24.64,31.5 23.11,31.5 21.84,30.23 21.84,20.57 U$1.P$4

### Text on the board
tNames: D4 | D5 | D6 | D11 | D12 | Pineapple / 1.0.0 / Pineapple Design | / | USB